# EAGLE design box-d4mg (EAGLE 5.11)
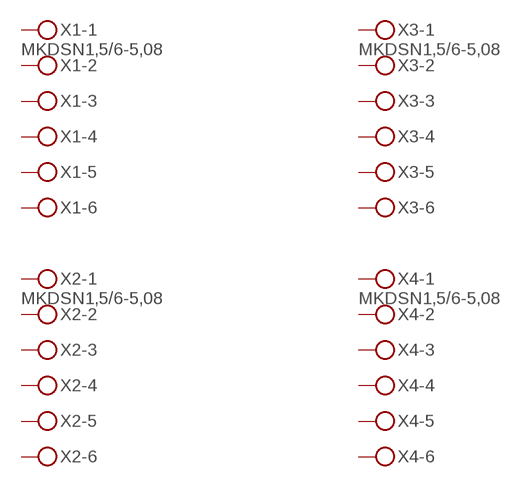
[diagram p0: schematic, sheet 1]

## Parts
X1  MKDSN1,5/6-5,08  [MKDSN1,5/6-5,08]
X2  MKDSN1,5/6-5,08  [MKDSN1,5/6-5,08]
X3  MKDSN1,5/6-5,08  [MKDSN1,5/6-5,08]
X4  MKDSN1,5/6-5,08  [MKDSN1,5/6-5,08]
Unconnected: X1.1 X1.2 X1.3 X1.4 X1.5 X1.6 X2.1 X2.2 X2.3 X2.4 X2.5 X2.6 X3.1 X3.2 X3.3 X3.4 X3.5 X3.6 X4.1 X4.2 X4.3 X4.4 X4.5 X4.6

## Library data of the parts
X1-X4 = con-phoenix-508:MKDSN1,5/6-5,08: MKDSN 1,5/ 6-5,08 Printklemme Nennstrom: 13,5 A Nennspannung: 250 V Rastermaß: 5,08 mm Polzahl: 6 Anschlussart: Schraubanschluss Montage: Löten Anschlussrichtung Leiter/Platine: 0 ° Artikelnummer: 1729160 Source: http://eshop.phoenixcontact.com .. 1729160.pdf

## Board
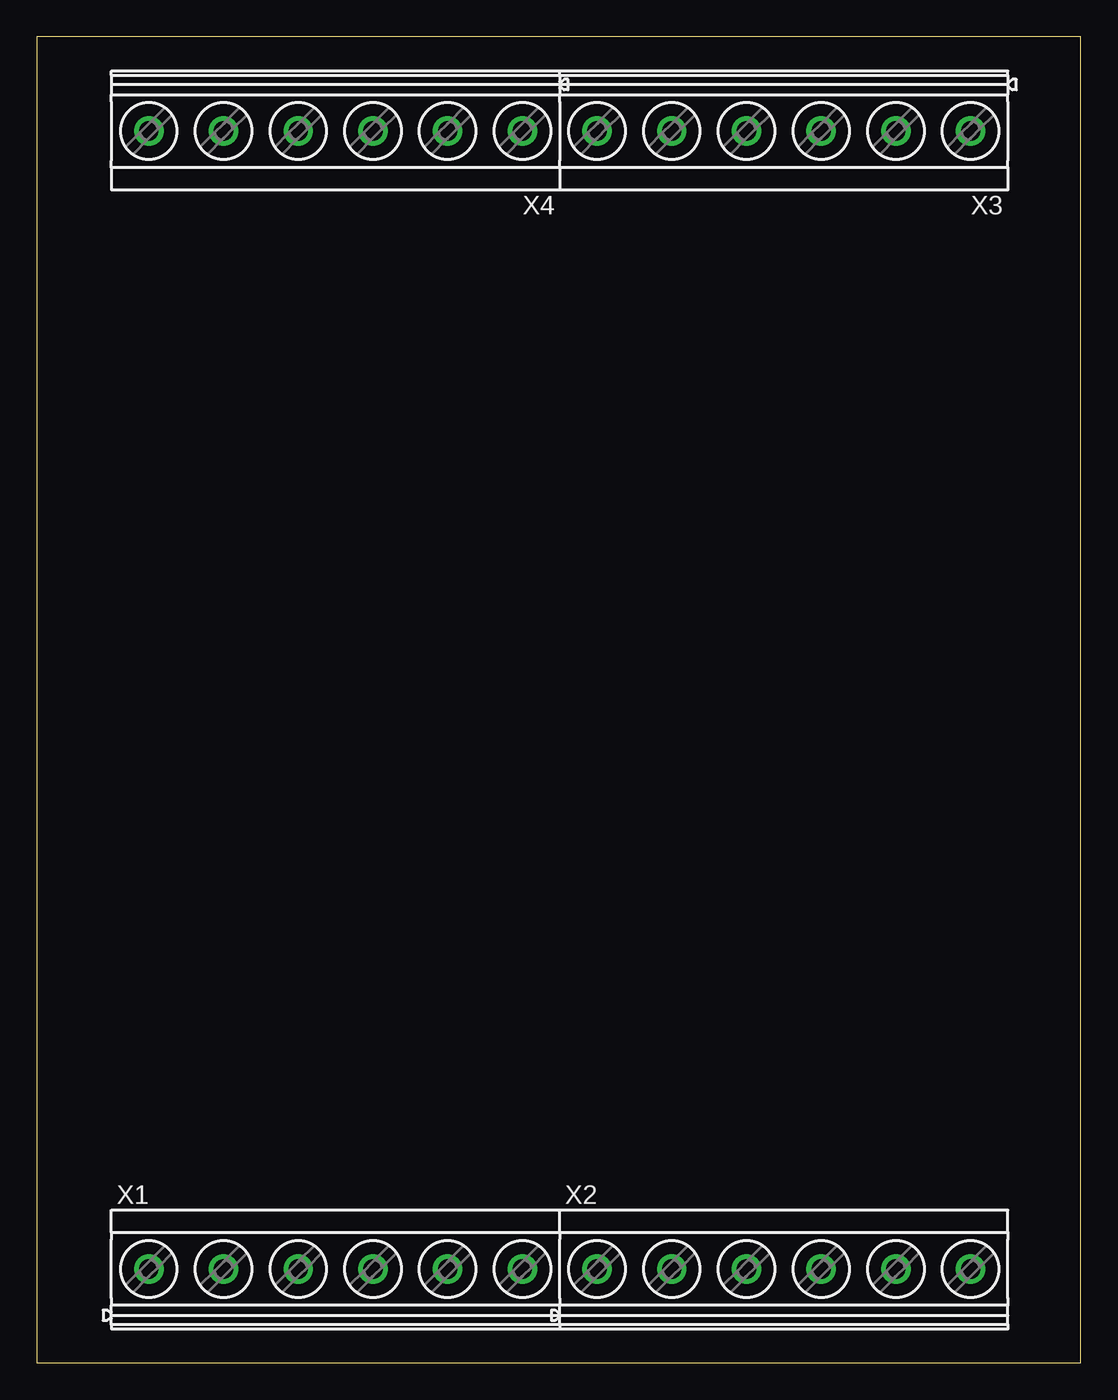
[diagram p1: board, top side]
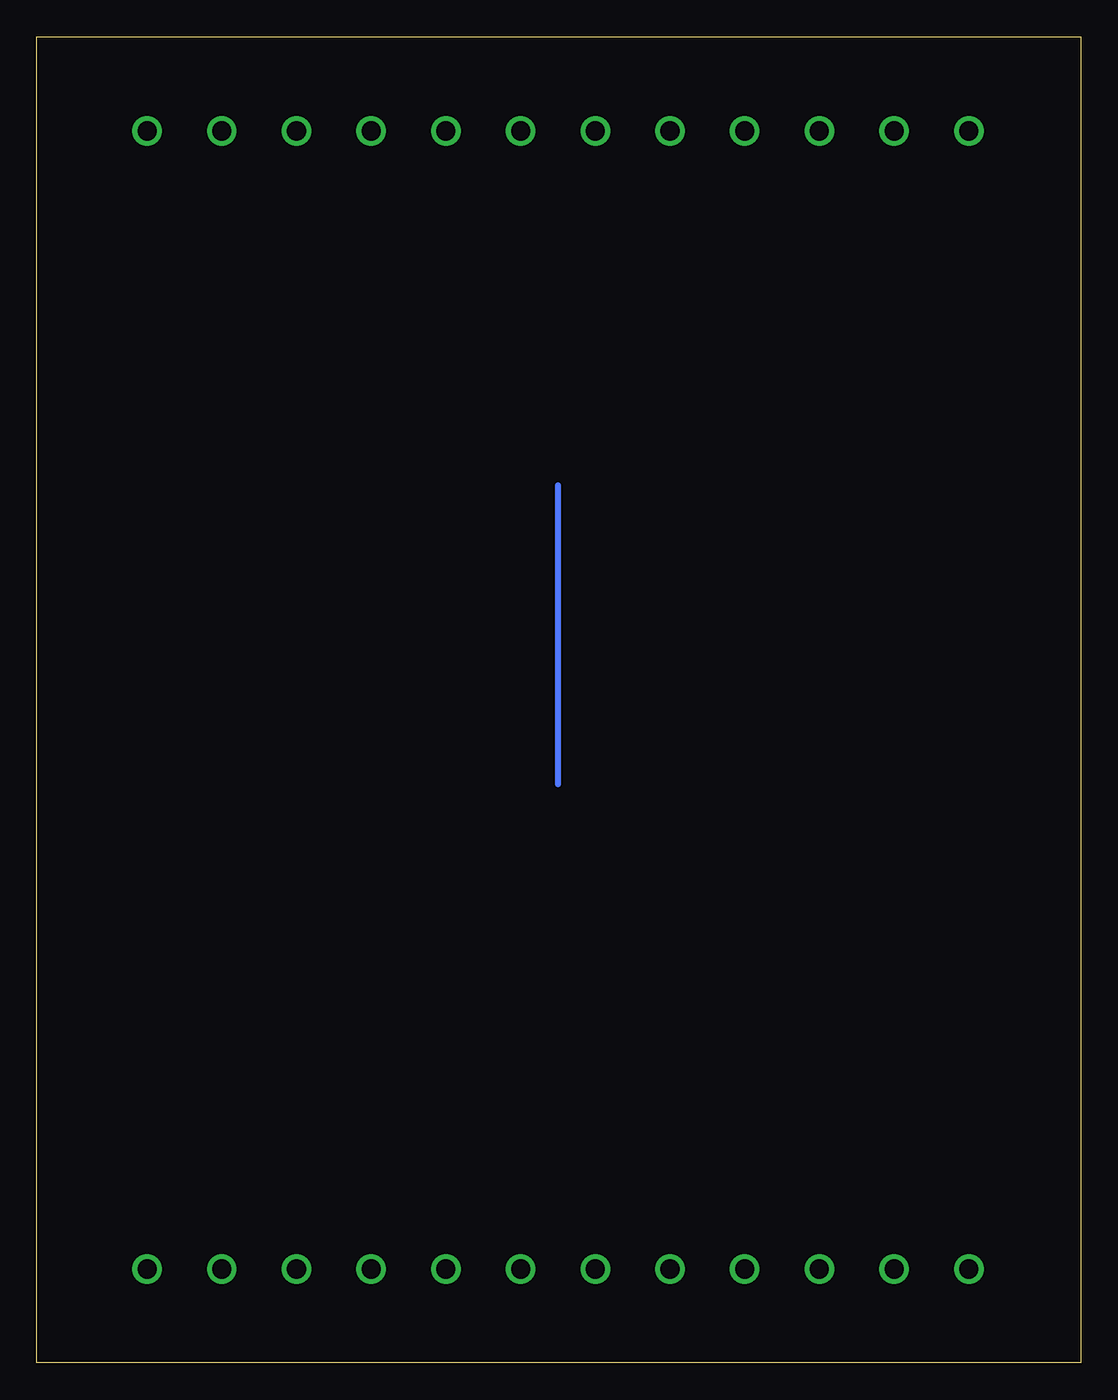
[diagram p2: board, bottom side, seen from below]

Size 71 x 90.2 mm. Coordinates in mm from the lower left corner, seen from the top.
Outline: 0,0 71,0 71,90.2 0,90.2 0,0
Copper layers (1*16): Top 0.035mm / dielectric 1.5mm / Bottom 0.035mm
Design rules "default": minimum track width 10mil, minimum drill 24mil, track to track 8mil, track to pad 8mil, pad to pad 8mil, via to via 8mil, smd to smd 8mil, copper to edge 40mil, drill to drill 8mil, minimum pad ring 10mil, minimum via ring 8mil, stop-mask expansion 4mil, vias tented up to drill 0mil, thermal gap 10mil

### Footprints (pad centres in the part's own frame; a part is rotated, then mirrored left to right if it is on the bottom)
MKDSN1,5/6-5,08 = drill 1.3 pad 2 round: 1 -12.7,0.025; 2 -7.62,0.025; 3 -2.54,0.025; 4 2.54,0.025; 5 7.62,0.025; 6 12.7,0.025

### Placement (x,y rotation side)
X1  20.32,6.35 0 top
X2  50.8,6.35 0 top
X3  50.8,83.82 180 top
X4  20.32,83.82 180 top

### Tracks (layer width: path | path; a pad name or v marks a point on that pad's centre or on a via)
N$1
  Bottom 0.406: 35.56,59.69 35.56,39.37